# Altium schematic sheet LED_RGB.SchDoc: LED RGB
size A4; SheetNumber: 11; SheetTotal: 11
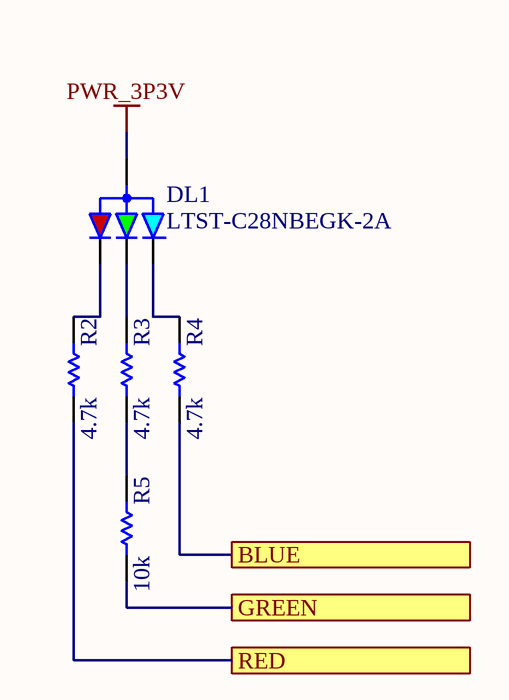
[diagram p0: LED_RGB.SchDoc]

## Parts
DL1  LTST-C28NBEGK-2A  [SMLP34RGB2W]
R2  value 4.7k  [RES-0402]  (hidden comment: RC0402FR-074K7L)
R3  value 4.7k  [RES-0402]  (hidden comment: RC0402FR-074K7L)
R4  value 4.7k  [RES-0402]  (hidden comment: RC0402FR-074K7L)
R5  value 10k  [RES-0402]  (hidden comment: CRCW040210K0FKED)

## Ports
BLUE, GREEN, RED

## Nets
PWR_3P3V: DL1.1(ANODE)
BLUE: R4.1 ; port BLUE
GREEN: R5.2 ; port GREEN
RED: R2.1 ; port RED
NetDL1_2: DL1.2(RED_C) R2.2
NetDL1_3: DL1.3(BLUE_C) R4.2
NetDL1_4: DL1.4(GREEN_C) R3.2
NetR3_1: R3.1 R5.1

## Notes on the sheet
- Title:
- ID:
- Date:
- Time:
- Version:
- Sheet
- of
- RevAuthor:
- Reference Designs ARE PROVIDED "AS IS" AND "WITH ALL FAULTS. Arduino SA DISCLAIMS ALL OTHER WARRANTIES, EXPRESS OR IMPLIED, REGARDING PRODUCTS, INCLUDING BUT NOT LIMITED TO, ANY IMPLIED WARRANTIES OF MERCHANTABILITY OR FITNESS FOR A PARTICULAR PURPOSE.
  Arduino SA may make changes to specifications and product descriptions at any time, without notice. The Customer must not rely on the absence or characteristics of any features or instructions marked "reserved" or "undefined". Arduino SA reserves these for future definition and shall have no responsibility whatsoever for conflicts or incompatibilities arising from future changes to them. The product information on the Web Site or Materials is subject to change without notice.
  Do not finalize a design with this info. ARDUINO and other Arduino brands and logos and Trademarks of Arduino SA. All Arduino SA Trademarks cannot be used without owner's formal permission.
- File:
- Author:

## Library data of the parts
DL1 = L0014-A.13: LED RGB DIFFUSED PICOLED SMD; Manufacturer: Liteon; Code Arduino: A5469; Dominant Wavelength: 470nm; Forward Current: 20mA; Luminous Intensity: 45mcd; Forward Voltage: 3V; Lens Color: White; Lens Style: Rectangular; Test Current: 5mA; Pin Count: 4; Part Number: LTST-C28NBEGK-2A; Length: 1mm; Color: Blue,Green,Red; Width: 1mm; Lens Transparency: Diffused; Case Code (Imperial): 0404; Min Operating Temperature: -40°C; Height: 0.25mm; Max Operating Temperature: 85°C
R2-R4 = R0013-A.24: RES CHIP 0402 4k7 1% 1/16W; Manufacturer: YAGEO; Code Arduino: 2196; Power: 62.5mW; Temperature coefficient: 200ppm; Part Number: RC0402FR-074K7L; Tolerance: 1%; Case Code (Imperial): 0402; Technology: Thick film
R5 = R0003-A.24: RES CHIP 0402 10k 1% 1/16W; Manufacturer: Vishay; Code Arduino: 0136; Power: 62.5mW; Temperature coefficient: 100ppm; Case Code (Imperial): 0402; Part Number: CRCW040210K0FKED; Technology: Thick film; Tolerance: 1%